# Altium schematic sheet Sheet1.SchDoc
size B; SheetNumber: 1; SheetTotal: 1
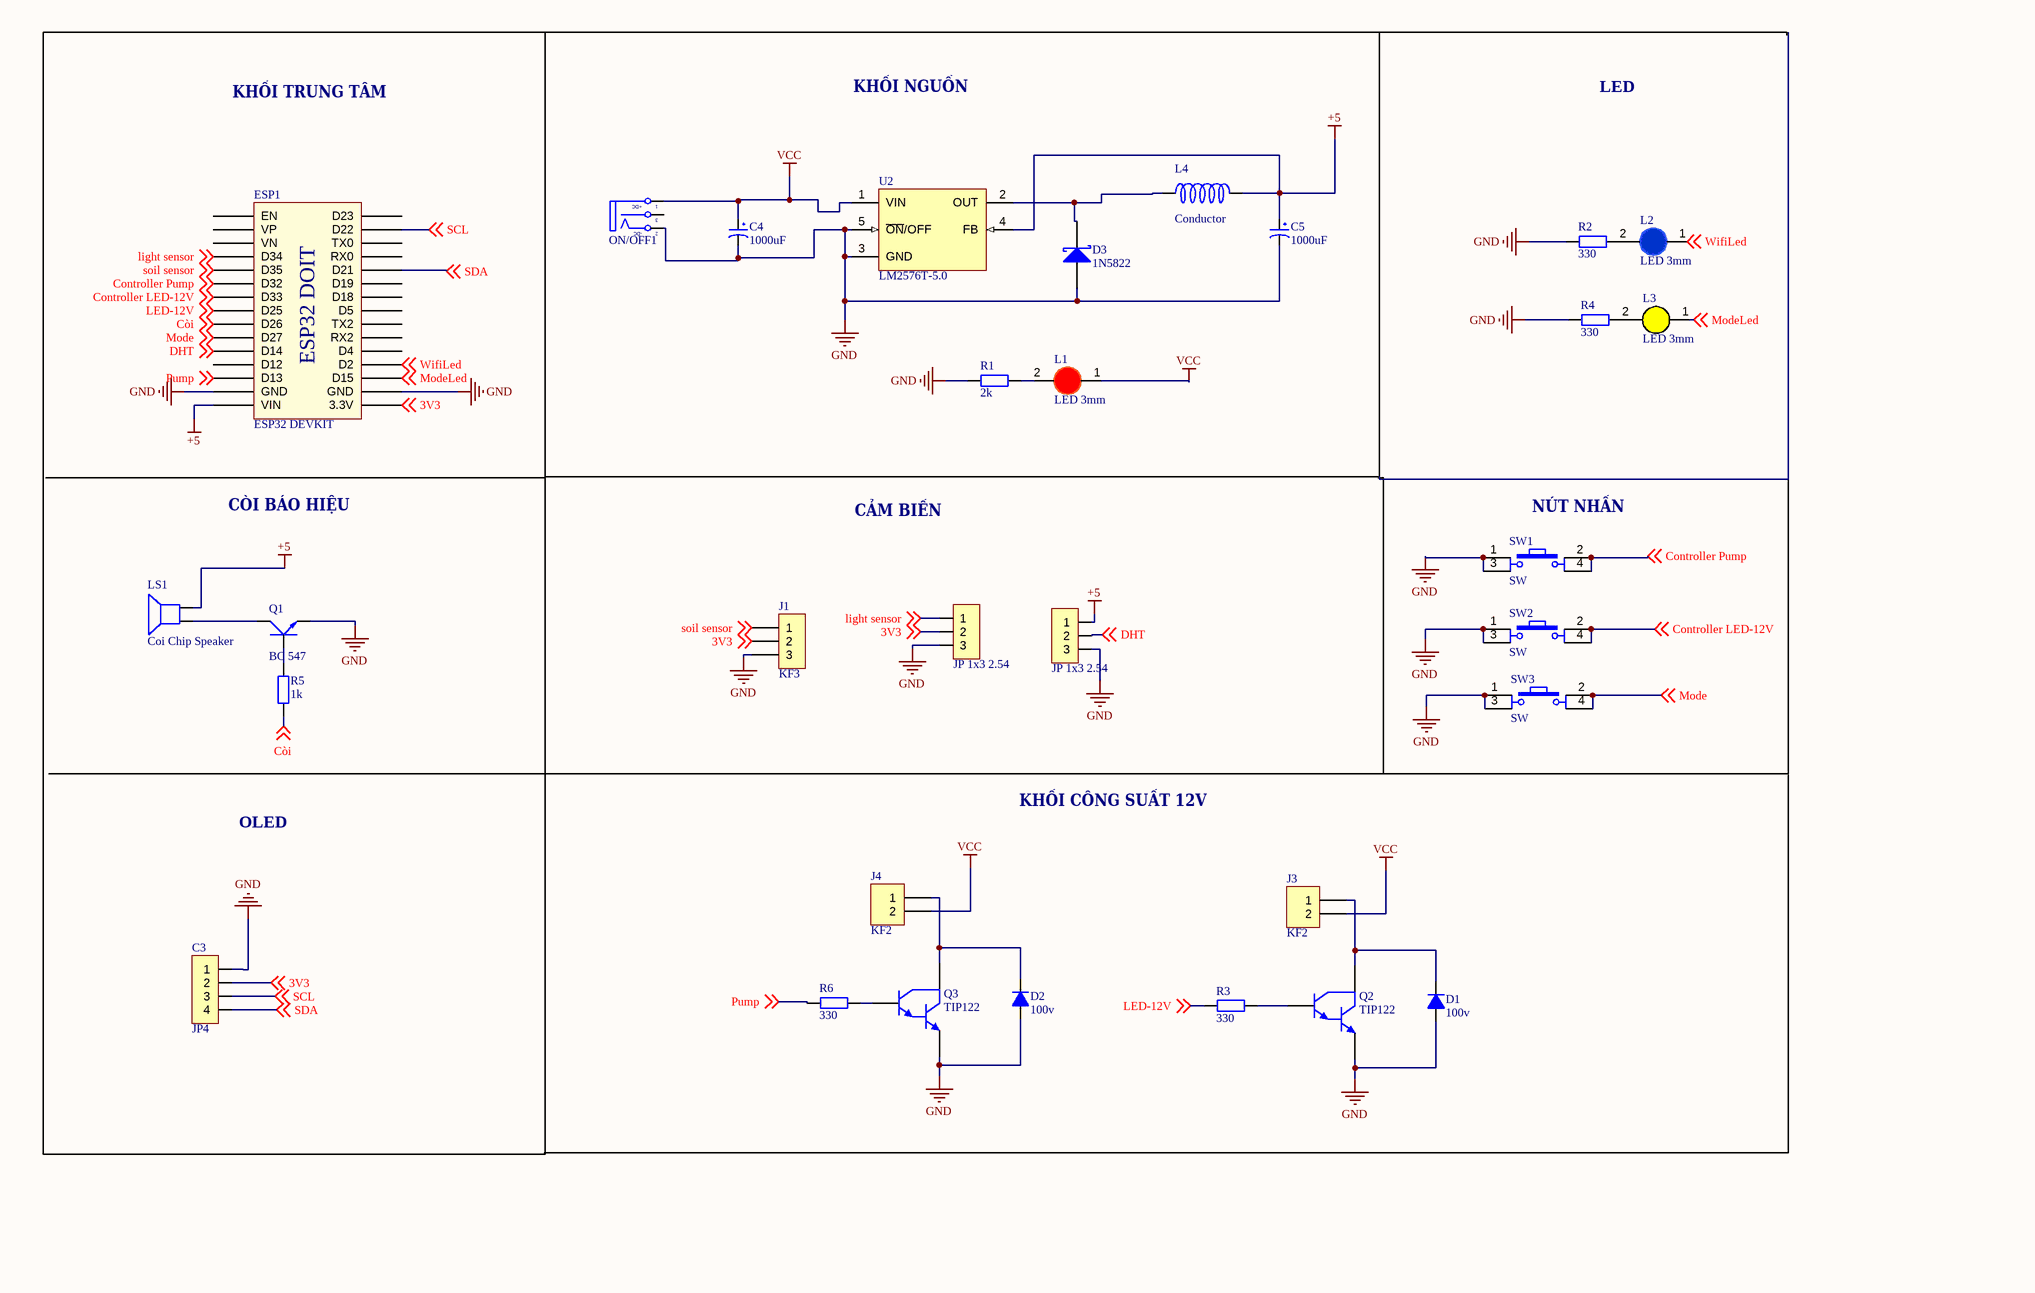
[diagram p0: Sheet1.SchDoc]

## Parts
C3  JP4  [JP4-C1T]
C4  1000uF  [tu hoa 13mm]
C5  1000uF  [tu hoa 13mm]
D1  100v  [DIODE 1A]
D2  100v  [DIODE 1A]
D3  1N5822  [DIODE 10A]
ESP1  ESP32 DEVKIT  [ESP32 WROOM 32 KIT]
J1  KF3  [KF3-5.08]
J3  KF2  [KF2-5.08]
J4  KF2  [KF2-5.08]
JP2  JP 1x3 2.54  [JP 1x3 CT]
JP?  JP 1x3 2.54  [JP 1x3 DT]
L1  LED 3mm  [LED-3MM-RED]
L2  LED 3mm  [LED-3MM-BLUE]
L3  LED 3mm  [LED-3MM-YELLOW]
L4  Conductor  [CUON CAM 200mil]
LS1  Coi Chip Speaker  [Coi Chip Speacker]
ON/OFF1  POWER  [DC-IN]  (value not drawn)
Q1  BC 547  [QTO-92]
Q2  TIP122  [QTO-220]
Q3  TIP122  [QTO-220]
R1  2k  [tro vach 1/4w]
R2  330  [tro vach 1/4w]
R3  330  [tro vach 1/4w]
R4  330  [tro vach 1/4w]
R5  1k  [tro vach 1/4w]
R6  330  [tro vach 1/4w]
SW1  SW  [SW4]
SW2  SW  [SW4]
SW3  SW  [SW4]
U2  LM2576T-5.0  [LM2576t]

## Nets
+5: C5.1 ESP1.15(VIN) JP2.1 L4.2 LS1.2 U2.4(FB)
GND: C3.1 C4.2 C5.2 D1.1(A) D2.1(A) D3.1(A) ESP1.14(GND) ESP1.17(GND) J1.3 JP2.3 JP?.3 ON/OFF1.2(TN) Q1.3(E) Q2.3(E) Q3.3(E) R1.2 R2.2 R4.2 SW1.1 SW1.3 SW2.1 SW2.3 SW3.1 SW3.3 U2.3(GND) U2.5(~{ON}/OFF)
VCC: C4.1 J3.2 J4.2 L1.1(A) ON/OFF1.1(T) U2.1(VIN)
3V3: C3.2 ESP1.16(3.3V) J1.2 JP?.2 ; off-sheet 3V3
Controller LED-12V: ESP1.7(D33) SW2.2 SW2.4 ; off-sheet Controller LED-12V
Controller Pump: ESP1.6(D32) SW1.2 SW1.4 ; off-sheet Controller Pump
Còi: ESP1.9(D26) R5.1 ; off-sheet Còi
DHT: ESP1.11(D14) JP2.2 ; off-sheet DHT
LED-12V: ESP1.8(D25) R3.2 ; off-sheet LED-12V
light sensor: ESP1.4(D34) JP?.1 ; off-sheet light sensor
Mode: ESP1.10(D27) SW3.2 SW3.4 ; off-sheet Mode
ModeLed: ESP1.18(D15) L3.1(A) ; off-sheet ModeLed
Pump: ESP1.13(D13) R6.2 ; off-sheet Pump
SCL: C3.3 ESP1.29(D22) ; off-sheet SCL
SDA: C3.4 ESP1.26(D21) ; off-sheet SDA
soil sensor: ESP1.5(D35) J1.1 ; off-sheet soil sensor
WifiLed: ESP1.19(D2) L2.1(A) ; off-sheet WifiLed
NetD1_2: D1.2(K) J3.1 Q2.2(C)
NetD2_2: D2.2(K) J4.1 Q3.2(C)
NetD3_2: D3.2(K) L4.1 U2.2(OUT)
NetL1_2: L1.2(K) R1.1
NetL2_2: L2.2(K) R2.1
NetL3_2: L3.2(K) R4.1
NetLS1_1: LS1.1 Q1.1(C)
NetQ1_2: Q1.2(B) R5.2
NetQ2_1: Q2.1(B) R3.1
NetQ3_1: Q3.1(B) R6.1

Not connected (* = marked no-connect by the designer): ESP1 1(EN) 2(VP) 3(VN) 12(D12) 20(D4) 21(RX2) 22(TX2) 23(D5) 24(D18) 25(D19) 27(RX0) 28(TX0) 30(D23); ON/OFF1 3(S)

## Notes on the sheet
- KHỐI TRUNG TÂM
- KHỐI NGUỒN
- LED
- CÒI BÁO HIỆU
- CẢM BIẾN
- (near SW1) NÚT NHẤN
- OLED
- KHỐI CÔNG SUẤT 12V
- THIS DOCUMENT AND THE DATA DISCLOSED HEREIN OR
- HEREWITH IS THE PROPERTY OF ALTIUM LIMITED AND MAY
- DWG NO:
- REVISION
- REV:
- DESCRIPTION
- DATE
- APPROVED
- BE FREELY DISTRIBUTED IN WHOLE. NO RIGHTS ARE
- RESERVED OR EXPRESS OR IMPLIED WARANTEE GIVEN.
- ENG:
- APPROVALS
- PROJECT
- DSN:
- CHK:
- REFERENCE DOCUMENTS
- PROJECT REVISION:
- TITLE
- DOCUMENT REVISION:
- DESIGN ITEM:
- BOM:
- FAB DWG:
- PCB DWG:
- ASSY DWG:
- SCALE:
- A3
- SIZE
- CAGE CODE
- FILE NAME
- DWG NO.
- SHEET
- OF
- REV
- (in symbol DCIN) +DC; -DC
- (in symbol ESP32 WROOM 32 KIT) ESP32 DOIT

## Library data of the parts
C3 = JP4: WR-PHD 2.54 mm Angled Socket Header; Manufacturer: W¨¹rth Elektronik eiSos GmbH; partNo: 613004143121; ComponentLink1 Description: Manufacturer; ComponentLink2 Description: Datasheet; NoPins: 04; Created Date: 29 March 2013; ComponentLink1URL: http://www.we-online.com; ComponentLink2URL: http://katalog.we-online.de/em/datasheet/6130xx143121.pdf; Created by: Karrer Zheng
C4 = Tu Hoa 1000uF 25V 13x21: Cắm; Don_Vi: Con; So_Chan: 2; Ten_Linh_Kien: Tụ Hóa 1000uF 25V 13x21MM; Ma_Hang: MH002315; Chung_Loai: Cắm; Kieu_Chan: *
C5 = Tu Hoa 1000uF 50V 13x26: Cắm; Don_Vi: Con; So_Chan: 2; Ten_Linh_Kien: Tụ Hóa 1000uF 50V; Ma_Hang: MH006619; Chung_Loai: Cắm; Kieu_Chan: *
D1 D2 = Diode 1N4007: Cắm; Ten_Linh_Kien: Diode 1N4007 1A (DIP); Don_Vi: Con; Ma_Hang: MH001063; Ghi Chu: *; Kieu_Chan: *; Chung_Loai: Cắm
D3 = DIODE Schottky
ESP1 = ESP32 WROOM 32 KIT
J1 = KF3: Manufacturer: Würth Elektronik eiSos GmbH; partNo: 691103110003; ComponentLink1 Description: Manufacturer; ComponentLink2 Description: Datasheet; NoPins: 3; Created Date: 29 October 2013; ComponentLink1URL: http://www.we-online.com; ComponentLink2URL: http://katalog.we-online.de/em/datasheet/6911031100xx.pdf; Created by: Karrer Zheng
J3 J4 = KF2: Manufacturer: Würth Elektronik eiSos GmbH; partNo: 691103110002; ComponentLink1 Description: Manufacturer; ComponentLink2 Description: Datasheet; NoPins: 2; Created Date: 29 October 2013; ComponentLink1URL: http://www.we-online.com; ComponentLink2URL: http://katalog.we-online.de/em/datasheet/6911031100xx.pdf; Created by: Karrer Zheng
JP2 = JP 1x3 2.54 Cai Thang: Cắm; Ten_Linh_Kien: Jump Đơn Cái 2.54MM 1x20P Thẳng; Don_Vi: Con; Ma_Hang: MH004006; Ghi_Chu: *; Kieu_Chan: *; Chung_Loai: Cắm
JP? = JP 1x3 2.54 Duc Thang: Cắm; Ten_Linh_Kien: Jump Đơn Đực 2.54MM 1x40P Thẳng 11MM; Don_Vi: Con; Ma_Hang: MH000903; Ghi_Chu: *; Kieu_Chan: *; Chung_Loai: Cắm
L1 = LED 3mm Do: Cắm; Don_Vi: Con; Ma_Hang: MH003892; Ten_Linh_Kien: Led 3MM Phủ Đỏ (10c); Ghi_Chu: *; Kieu_Chan: *; Chung_Loai: Cắm
L2 = LED 3mm Xanh Duong: Cắm; Don_Vi: Con; Ma_Hang: MH009003; Ten_Linh_Kien: LED 3MM Xanh Dương SS (1000c); Ghi_Chu: *; Kieu_Chan: *; Chung_Loai: Cắm
L3 = LED 3mm Vang: Cắm; Don_Vi: Con; Ma_Hang: MH003893; Ten_Linh_Kien: Led 3MM Phủ Vàng (10c); Ghi_Chu: *; Kieu_Chan: *; Chung_Loai: Cắm
LS1 = Coi Chip Speaker: Còi chip
ON/OFF1 = DCIN
Q1 = BC 546: NPN 625mW, CBE; Value: BC 546,BC 547,BC 548
Q2 Q3 = TIP122: Darlington Silicon Power NPN Transistor, 8 Amp, 100 Volts and 65 Watts
R1-R6 = Tro Vach 1/4W 5% 1k: Cắm; Don_Vi: Con; So_Chan: 2; Ten_Linh_Kien: Trở Vạch 1/4w 5% 1k; Ma_Hang: MH007390; Chung_Loai: Cắm; Kieu_Chan: *
SW1-SW3 = SW4: Switch button 4 pin; Value: Button chip 4 pin
U2 = LM2576T-5.0: SIMPLE SWITCHER; 3A Step-Down Voltage Regulator; Manufacturer: National Semiconductor; PackageTopMarking: NSUZXYTT*LM2576T*-5.0 P+; PowerWise: N; FirstPublished: 4-Dec-2008; DatasheetVersion: Aug-2004; PackageVersion: revJ, Jan-1992; PackageReference: T05A; Publisher: Altium Limited; PackageDescription: TO-220, Molded, 5 Lead, Straight; CompType: Switcher; PartNumber: LM2576T-5.0; RoHS: O; PinCount: 5; DigiKeyPartNumber: LM2576T-5.0-ND; Code_JEDEC: TO-220-AB; ComponentLink1Description: LM2576 Datasheet; ComponentLink1URL: http://www.national.com/ds/LM/LM2576.pdf; ComponentLink2Description: LM2576 Web Page; ComponentLink2URL: http://www.national.com/pf/LM/LM2576.html; ComponentLink3Description: T05A Package Page; ComponentLink3URL: http://www.national.com/packaging/folders/t05a.html